# EasyEDA Pro project ProPrj_六无刷——关节电机C_2026-07-28.epro, schematic Schematic1
Board Name: Board1; Create Date: 2026-04-03; Page Name: P1; Project Name: 六无刷——关节电机C; Schematic Name: Schematic1; Update Date: 2026-06-08; Company: 嘉立创EDA; Page Size: A4; Version: V1.0
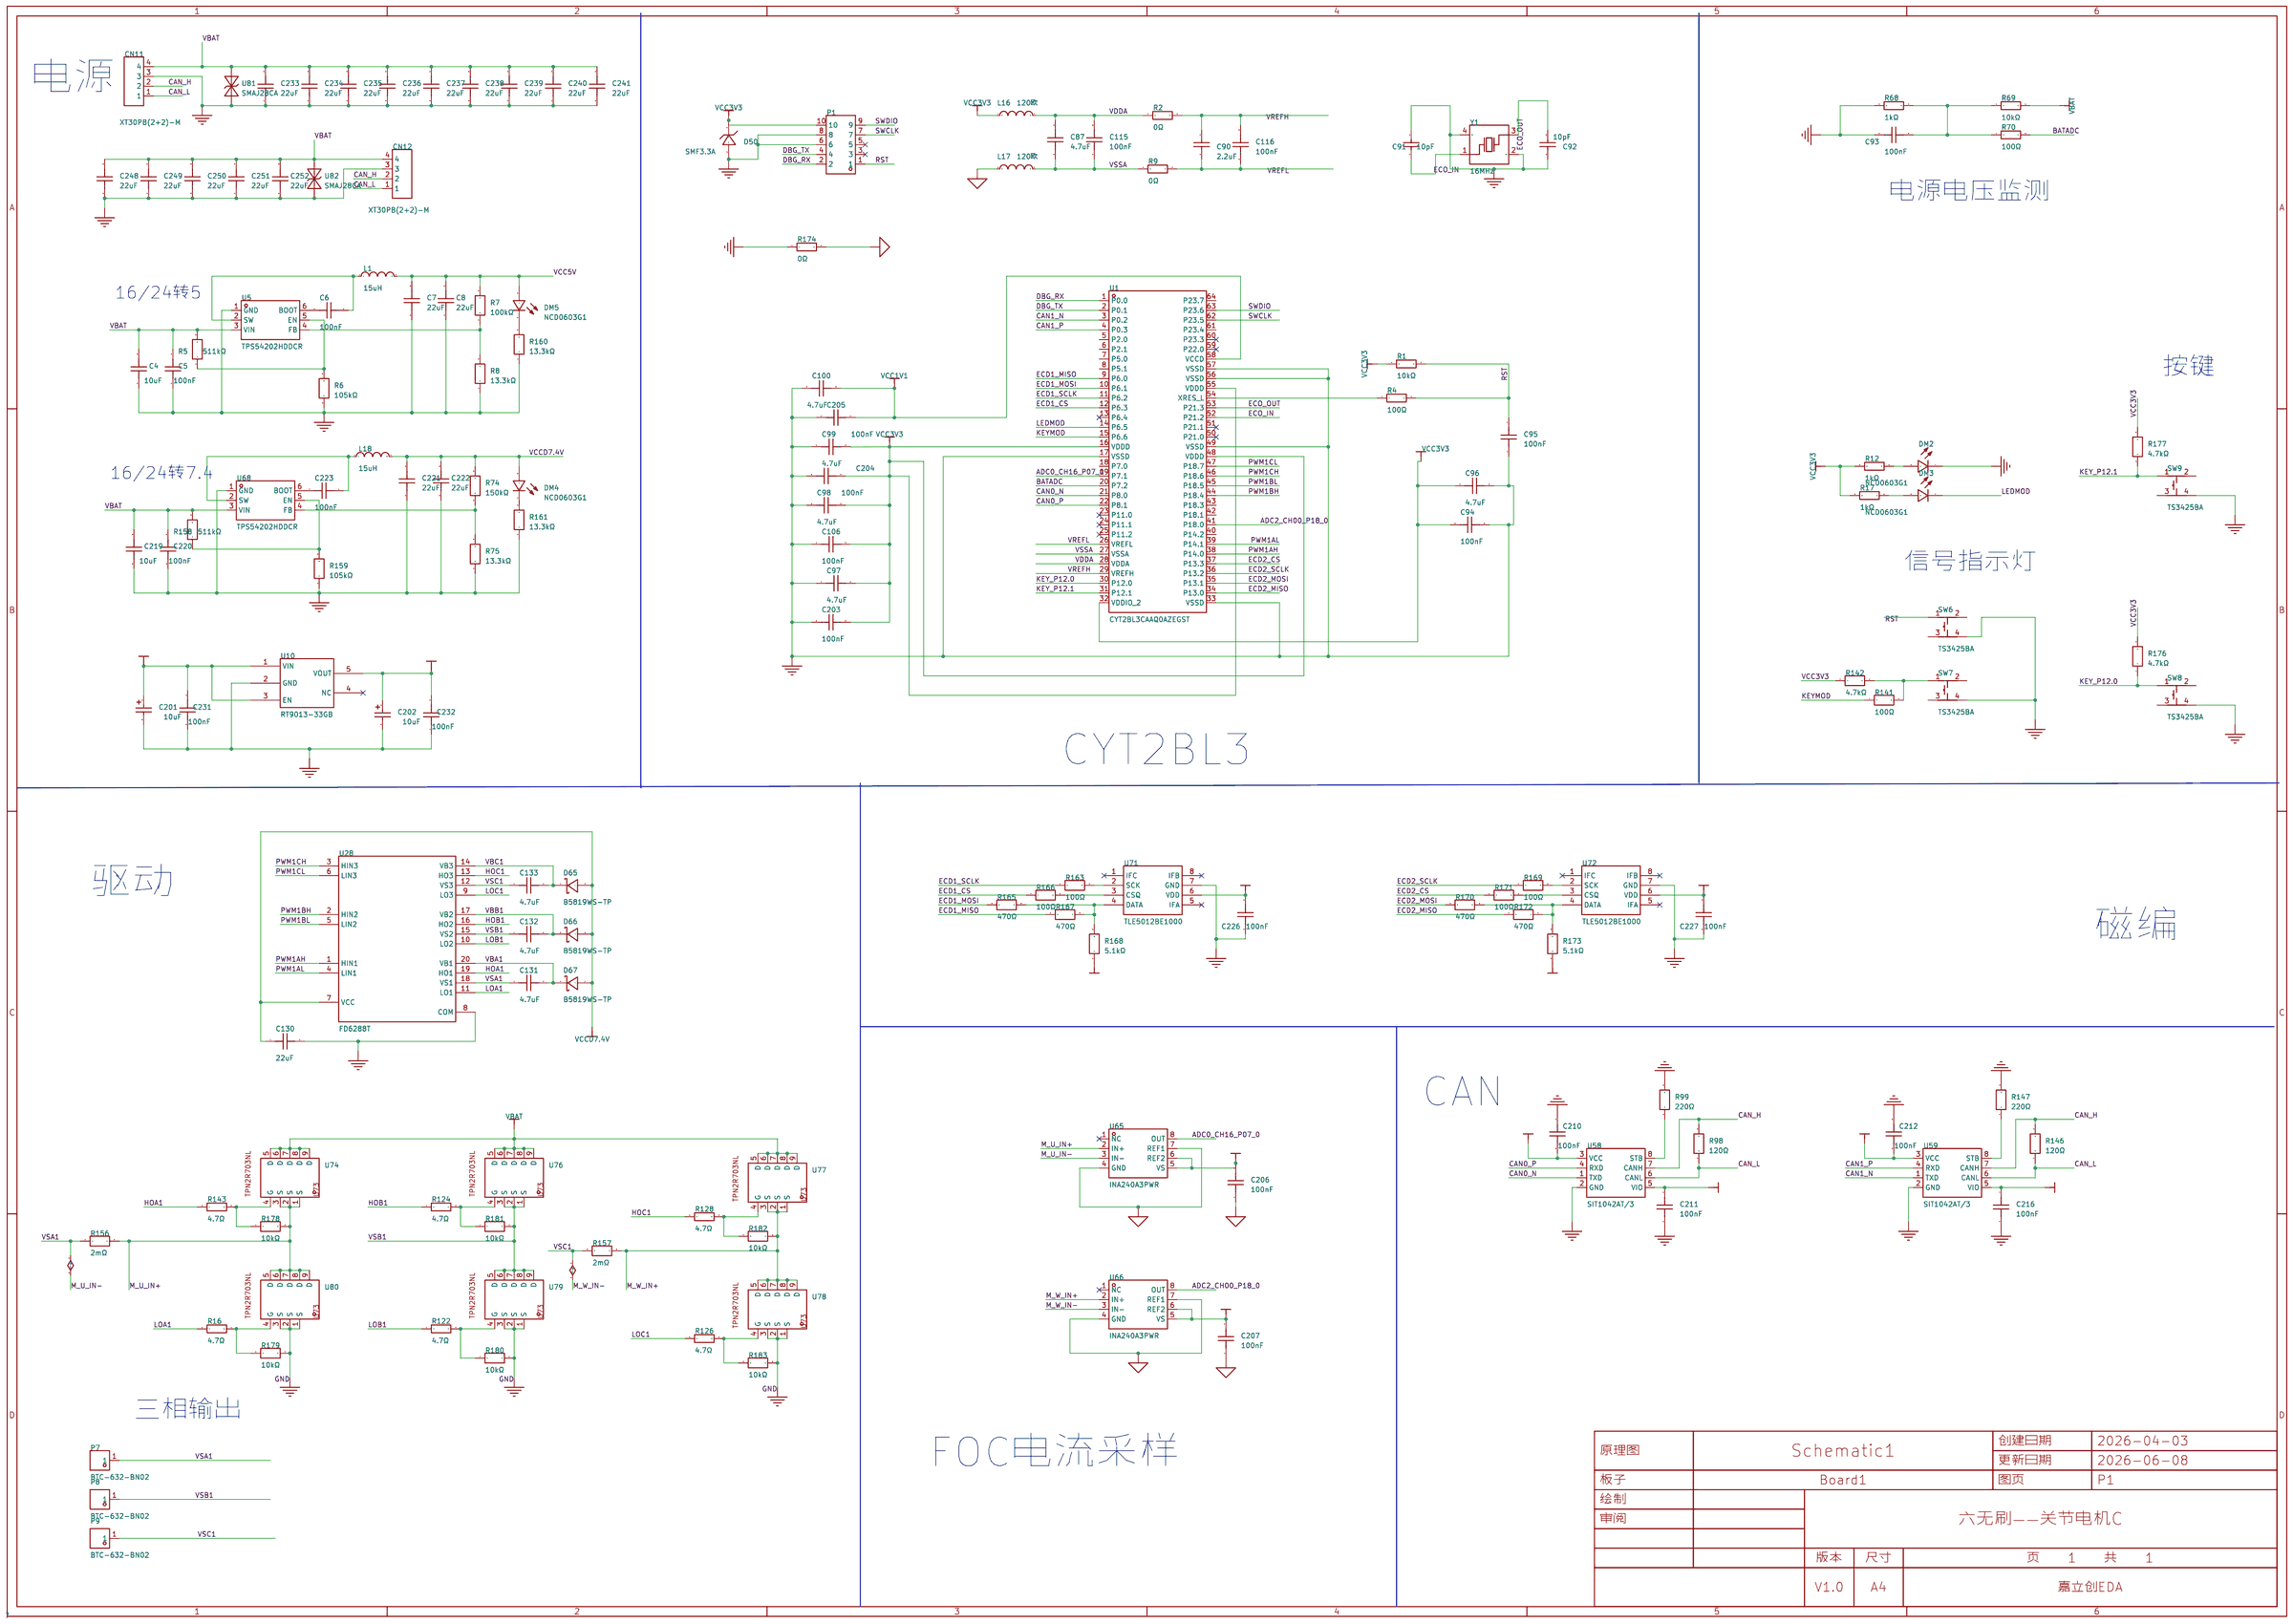
[diagram p0: schematic sheet]

## Parts
C4  10uF  [C0603]
C5  100nF  [C0603]
C6  100nF  [C0603]
C7  22uF  [C0603]
C8  22uF  [C0603]
C87  4.7uF  [C0603]
C90  2.2uF  [C0603]
C91  10pF  [C0402]
C92  10pF  [C0402]
C93  100nF  [C0603]
C94  100nF  [C0603]
C95  100nF  [C0603]
C96  4.7uF  [C0603]
C97  4.7uF  [C0603]
C98  4.7uF  [C0603]
C99  4.7uF  [C0603]
C100  4.7uF  [C0603]
C106  100nF  [C0603]
C115  100nF  [C0603]
C116  100nF  [C0603]
C130  22uF  [C0603]
C131  4.7uF  [C0603]
C132  4.7uF  [C0603]
C133  4.7uF  [C0603]
C201  10uF  [CAP-SMD_L3.2-W1.6-RD-C7171]
C202  10uF  [CAP-SMD_L3.2-W1.6-RD-C7171]
C203  100nF  [C0603]
C204  100nF  [C0603]
C205  100nF  [C0603]
C206  100nF  [C0603]
C207  100nF  [C0603]
C210  100nF  [C0603]
C211  100nF  [C0603]
C212  100nF  [C0603]
C216  100nF  [C0603]
C219  10uF  [C0603]
C220  100nF  [C0603]
C221  22uF  [C0603]
C222  22uF  [C0603]
C223  100nF  [C0603]
C226  100nF  [C0603]
C227  100nF  [C0603]
C231  100nF  [C0603]
C232  100nF  [C0603]
C233  22uF  [C1206]
C234  22uF  [C1206]
C235  22uF  [C1206]
C236  22uF  [C1206]
C237  22uF  [C1206]
C238  22uF  [C1206]
C239  22uF  [C1206]
C240  22uF  [C1206]
C241  22uF  [C1206]
C248  22uF  [C1206]
C249  22uF  [C1206]
C250  22uF  [C1206]
C251  22uF  [C1206]
C252  22uF  [C1206]
CN11  XT30PB(2+2)-M  [CONN-TH_XT30PB-M]
CN12  XT30PB(2+2)-M  [CONN-TH_XT30PB-M]
D50  SMF3.3A  [SOD-123_L2.8-W1.8-LS3.7-RD]
D65  B5819WS-TP  [SOD-323_L1.8-W1.3-LS2.5-RD]
D66  B5819WS-TP  [SOD-323_L1.8-W1.3-LS2.5-RD]
D67  B5819WS-TP  [SOD-323_L1.8-W1.3-LS2.5-RD]
DM2  NCD0603G1  [LED0603-RD]
DM3  NCD0603G1  [LED0603-RD]
DM4  NCD0603G1  [LED0603-RD]
DM5  NCD0603G1  [LED0603-RD]
L1  15uH  [IND-SMD_L7.0-W6.6_FXL0630]
L16  120欧  [L0603]
L17  120欧  [L0603]
L18  15uH  [IND-SMD_L7.0-W6.6_FXL0630]
P1  HDR2X5-2.54座  [HDR-TH_10P_C9900008731]
P7  BTC-632-BN02  [CONN-SMD_BTC-632-BN02]
P8  BTC-632-BN02  [CONN-SMD_BTC-632-BN02]
P9  BTC-632-BN02  [CONN-SMD_BTC-632-BN02]
R1  10kΩ  [R0603]
R2  0Ω  [R0603]
R4  100Ω  [R0603]
R5  511kΩ  [R0603]
R6  105kΩ  [R0603]
R7  100kΩ  [R0603]
R8  13.3kΩ  [R0603]
R9  0Ω  [R0603]
R12  1kΩ  [R0603]
R16  4.7Ω  [R0603]
R17  1kΩ  [R0603]
R68  1kΩ  [R0603]
R69  10kΩ  [R0603]
R70  100Ω  [R0603]
R74  150kΩ  [R0603]
R75  13.3kΩ  [R0603]
R98  120Ω  [R0603]
R99  220Ω  [R0603]
R122  4.7Ω  [R0603]
R124  4.7Ω  [R0603]
R126  4.7Ω  [R0603]
R128  4.7Ω  [R0603]
R141  100Ω  [R0603]
R142  4.7kΩ  [R0603]
R143  4.7Ω  [R0603]
R146  120Ω  [R0603]
R147  220Ω  [R0603]
R156  2mΩ  [R1206]
R157  2mΩ  [R1206]
R158  511kΩ  [R0603]
R159  105kΩ  [R0603]
R160  13.3kΩ  [R0603]
R161  13.3kΩ  [R0603]
R163  100Ω  [R0603]
R165  470Ω  [R0603]
R166  100Ω  [R0603]
R167  470Ω  [R0603]
R168  5.1kΩ  [R0603]
R169  100Ω  [R0603]
R170  470Ω  [R0603]
R171  100Ω  [R0603]
R172  470Ω  [R0603]
R173  5.1kΩ  [R0603]
R174  0Ω  [R0603]
R176  4.7kΩ  [R0603]
R177  4.7kΩ  [R0603]
R178  10kΩ  [R0603]
R179  10kΩ  [R0603]
R180  10kΩ  [R0603]
R181  10kΩ  [R0603]
R182  10kΩ  [R0603]
R183  10kΩ  [R0603]
SW6  TS3425BA  [SW-SMD_4P-L4.2-W3.2-P2.15-LS4.6-1]
SW7  TS3425BA  [SW-SMD_4P-L4.2-W3.2-P2.15-LS4.6-1]
SW8  TS3425BA  [SW-SMD_4P-L4.2-W3.2-P2.15-LS4.6-1]
SW9  TS3425BA  [SW-SMD_4P-L4.2-W3.2-P2.15-LS4.6-1]
U1  CYT2BL3CAAQ0AZEGST  [LQFP-64_L10.0-W10.0-P0.50-LS12.0-BL]
U5  TPS54202HDDCR  [SOT-23-6_L2.9-W1.6-P0.95-LS2.8-BL]
U10  RT9013-33GB  [SOT-25]
U28  FD6288T  [TSSOP-20_L6.5-W4.4-P0.65-LS6.4-BL]
U58  SIT1042AT/3  [SOIC-8_L4.9-W3.9-P1.27-LS6.0-BL]
U59  SIT1042AT/3  [SOIC-8_L4.9-W3.9-P1.27-LS6.0-BL]
U65  INA240A3PWR  [TSSOP-8_L4.4-W3.0-P0.65-LS6.4-BL-2]
U66  INA240A3PWR  [TSSOP-8_L4.4-W3.0-P0.65-LS6.4-BL-2]
U68  TPS54202HDDCR  [SOT-23-6_L2.9-W1.6-P0.95-LS2.8-BL]
U71  TLE5012BE1000  [PG-DSO-8_L5.0-W4.0-P1.27-LS6.0-BL]
U72  TLE5012BE1000  [PG-DSO-8_L5.0-W4.0-P1.27-LS6.0-BL]
U74  -  [TPN2R703NL改焊盘]
U76  -  [TPN2R703NL改焊盘]
U77  -  [TPN2R703NL改焊盘]
U78  -  [TPN2R703NL改焊盘]
U79  -  [TPN2R703NL改焊盘]
U80  -  [TPN2R703NL改焊盘]
U81  SMAJ28CA  [SMA_L4.3-W2.7-LS5.1-BI]
U82  SMAJ28CA  [SMA_L4.3-W2.7-LS5.1-BI]
Y1  16MHz  [CRYSTAL-SMD_4P-L3.2-W2.5-BL]

## Library data of the parts
C4 C219 = FCC0603X106M160CT: 容值:10uF;精度:±20%;额定电压:16V;温度系数:X5R;; LCSC Part Name: 10uF ±20% 16V; Supplier Part: C7467046; Manufacturer: FOJAN(富捷); Supplier Footprint: 0603; JLCPCB Part Class: 扩展库; Datasheet: https://item.szlcsc.com/datasheet/FCC0603X106M160CT/8513633.html; Supplier: LCSC; Tolerance: ±20%; Voltage Rating: 16V; Temperature Coefficient: X5R
C5 C6 C220 C223 C231 C232 = TCC0603X7R104K101CTM: 容值:100nF;精度:±10%;额定电压:100V;温度系数:X7R;; LCSC Part Name: 100nF ±10% 100V; Supplier Part: C48543656; Manufacturer: CCTC(三环); Supplier Footprint: 0603; Datasheet: https://item.szlcsc.com/datasheet/TCC0603X7R104K101CTM/50806427.html; Supplier: LCSC; Tolerance: ±10%; Voltage Rating: 100V; Temperature Coefficient: X7R
C7 C8 C221 C222 = FCC0603X226M160CT: 容值:22uF;精度:±20%;额定电压:16V;温度系数:X5R;; LCSC Part Name: 22uF ±20% 16V; Supplier Part: C46635925; Manufacturer: FOJAN(富捷); Supplier Footprint: 0603; Datasheet: https://item.szlcsc.com/datasheet/FCC0603X226M160CT/48791858.html; Supplier: LCSC; Tolerance: ±20%; Voltage Rating: 16V; Temperature Coefficient: X5R
C87 C96-C100 C131-C133 = CL10A475KO8NNNC: 容值:4.7uF;精度:±10%;额定电压:16V;材质(温度系数):X5R;; LCSC Part Name: 4.7uF ±10% 16V; Supplier Part: C19666; Manufacturer: SAMSUNG(三星); Supplier Footprint: 0603; JLCPCB Part Class: 基础库; Datasheet: https://atta.szlcsc.com/upload/public/pdf/source/20160218/1457707763339.pdf; Supplier: LCSC; Tolerance: ±10%; Voltage Rated: 16V; Temperature Coefficient: X5R
C90 = CL10A225KO8NNNC: 容值:2.2uF;精度:±10%;额定电压:16V;材质(温度系数):X5R;; LCSC Part Name: 2.2uF ±10% 16V; Supplier Part: C23630; Manufacturer: SAMSUNG(三星); Supplier Footprint: 0603; JLCPCB Part Class: 基础库; Datasheet: https://atta.szlcsc.com/upload/public/pdf/source/20160218/1457707763339.pdf; Supplier: LCSC; Tolerance: ±10%; Voltage Rated: 16V; Temperature Coefficient: X5R
C91 C92 = CC0402JRNPO9BN100: 容值:10pF;精度:±5%;额定电压:50V;材质(温度系数):NP0;; LCSC Part Name: 10pF ±5% 50V; Supplier Part: C106199; Manufacturer: YAGEO(国巨); Supplier Footprint: 0402; JLCPCB Part Class: 扩展库; Datasheet: https://atta.szlcsc.com/upload/public/pdf/source/20181008/C309499_21CC21451B82C39E3D92150FD6B30293.pdf; Supplier: LCSC; Tolerance: ±5%; Voltage Rated: 50V; Temperature Coefficient: NP0
C93-C95 C106 C115 C116 C203-C207 C226 C227 = CC0603KRX7R9BB104: 容值:100nF;精度:±10%;额定电压:50V;材质(温度系数):X7R;; LCSC Part Name: 100nF ±10% 50V; Supplier Part: C14663; Manufacturer: YAGEO(国巨); Supplier Footprint: 0603; Datasheet: https://atta.szlcsc.com/upload/public/pdf/source/20180910/C282072_33301C7F631E79921B82A8DAC6BCC5B3.pdf; Supplier: LCSC; Tolerance: ±10%; Voltage Rated: 50V; Temperature Coefficient: X7R
C130 = CGA0603X5R226M160JT: 容值:22uF;精度:±20%;额定电压:16V;材质(温度系数):X5R;; LCSC Part Name: 22uF ±20% 16V; Supplier Part: C6119868; Manufacturer: HRE(芯声); Supplier Footprint: 0603; JLCPCB Part Class: 扩展库; Supplier: LCSC; Tolerance: ±20%; Voltage Rated: 16V; Temperature Coefficient: X5R
C201 C202 = TAJA106K016RNJ: 容值:10uF;精度:±10%;额定电压:16V;等效串联电阻(ESR):3Ω@100kHz;; LCSC Part Name: 10uF ±10% 16V; Supplier Part: C7171; Manufacturer: Kyocera AVX; Supplier Footprint: CASE-A-3216-18(mm); JLCPCB Part Class: 基础库; Supplier: LCSC; Tolerance: ±10%; Voltage Rating: 16V; Equivalent Series Resistance(ESR): 3Ω@100kHz; Operating Temperature: -55℃~+125℃
C210-C212 C216 = TCC0603X7R104J101CT: 容值:100nF;精度:±5%;额定电压:100V;温度系数:X7R;; LCSC Part Name: 100nF ±5% 100V; Supplier Part: C18185760; Manufacturer: CCTC(三环); Supplier Footprint: 0603; JLCPCB Part Class: 扩展库; Datasheet: https://item.szlcsc.com/datasheet/TCC0603X7R104J101CT/19332534.html; Supplier: LCSC; Tolerance: ±5%; Voltage Rating: 100V; Temperature Coefficient: X7R
C233-C241 C248-C252 = CGA1206X5R226M100NT: 容值:22uF;精度:±20%;额定电压:10V;温度系数:X5R;; LCSC Part Name: 22uF ±20% 10V; Supplier Part: C53282218; Manufacturer: HRE(芯声); Supplier Footprint: 1206; JLCPCB Part Class: 扩展库; Datasheet: https://item.szlcsc.com/datasheet/CGA1206X5R226M100NT/56352666.html; Supplier: LCSC; Tolerance: ±20%; Voltage Rating: 10V; Temperature Coefficient: X5R
CN11 CN12 = XT30PB(2+2)-M: 连接器类型:板端/插座-闭口;结构:1x2P;间距:5mm;安装方式:直插;排数:1;每排PIN数:2;; LCSC Part Name: 1x2P 5mm 排数:1 每排P数:2; Supplier Part: C3040128; Manufacturer: AMASS(艾迈斯); Supplier Footprint: 插件,P=5mm; JLCPCB Part Class: 扩展库; Datasheet: https://item.szlcsc.com/datasheet/XT30PB(2%252B2)-M/3596557.html; Supplier: LCSC; Connector Type: 板端/插座-闭口; Number of Positions or Pins: 1x2P; Pitch: 5mm; Mounting Type: 直插; Number of Pins: 4P; Number of Rows: 1; Number of PINs Per Row: 2
D50 = SMF3.3A_C283866: 反向截止电压(Vrwm):3.3V;最大钳位电压:8V;峰值脉冲电流(Ipp)@10/1000us:25A;击穿电压:5.2V;; Supplier Part: C283866; Manufacturer: DOWO(东沃); Supplier Footprint: SOD-123FL; JLCPCB Part Class: 扩展库; Datasheet: https://atta.szlcsc.com/upload/public/pdf/source/20240321/1BA336232F2D97E4B026619682DB80D3.pdf; Supplier: LCSC; Reverse Stand-Off Voltage (Vrwm): 3.3V; Maximum Clamping Voltage: 8V; Peak Pulse Current (Ipp)@10/1000us: 25A; Breakdown Voltage: 5.2V; Reverse Leakage Current (Ir): 600uA; Type: TVS
D65-D67 = B5819WS-TP: 正向压降(Vf):600mV@1A;直流反向耐压(Vr):40V;平均整流电流(Io):1A;; LCSC Part Name: 电压:40V 电流:1A; Supplier Part: C78734; Manufacturer: MCC(美微科); Supplier Footprint: SOD-323; JLCPCB Part Class: 扩展库; Datasheet: https://atta.szlcsc.com/upload/public/pdf/source/20190308/C78734_7BD7F562D63F05C7B4187010ADA330AA.pdf; Supplier: LCSC; Forward Voltage (Vf@If): 600mV@1A; Reverse Voltage (Vr): 40V; Average Rectified Current (Io): 1A; Reverse Leakage Current (Ir): 1mA@40V
DM2-DM5 = NCD0603G1: Supplier Part: C84267; Supplier Footprint: 0603; Datasheet: https://atta.szlcsc.com/upload/public/pdf/source/20200820/C84267_04BA7703640BAC111D09F5EFB971FBF3.pdf; Supplier: LCSC
L1 L18 = FXL0630-150-M: 电感值:15uH;精度:±20%;额定电流:3A;饱和电流(Isat):4.5A;类型:一体成型电感;; LCSC Part Name: 15uH ±20% 4.5A; Supplier Part: C177243; Manufacturer: cjiang(长江微电); Supplier Footprint: SMD,6.6x7mm; JLCPCB Part Class: 扩展库; Datasheet: https://atta.szlcsc.com/upload/public/pdf/source/20240426/3189EA8206330E2108542F9E34E540E7.pdf; Supplier: LCSC; Tolerance: ±20%; Rated Current: 3A; Saturation Current (Isat): 4.5A; DC Resistance (DCR): 115mΩ; Type: 一体成型电感
L16 L17 = MGGB1608M501HT-LF: 标称阻抗@测试频率:500Ω@100MHz;误差:±25%;直流电阻(RDC):-;; LCSC Part Name: 单路 0603磁珠 阻抗500Ω@100MHz; Supplier Part: C281149; Manufacturer: microgate(麦捷科技); Supplier Footprint: 0603; JLCPCB Part Class: 扩展库; Datasheet: https://atta.szlcsc.com/upload/public/pdf/source/20200220/C486339_8AC995628986C74D95A8947231DBAF68.pdf; Supplier: LCSC; Impedance @ Frequency: 500Ω@100MHz; Tolerance: ±25%; Circuits: 1
P1 = HDR2X5-2.54座: Supplier Part: C9900008731; Supplier Footprint: MHDR2X5; JLCPCB Part Class: 扩展库; Supplier: LCSC
P7-P9 = BTC-632-BN02: 长6mm 宽3mm 厚2mm 黄铜镀镍导电铜块 SMD贴片编带载带小铜片 触点散热铜柱 新能源 高压大电流; LCSC Part Name: 长6mm 宽3mm 厚2mm 黄铜镀镍导电铜块 SMD贴片编带载带小铜片 触点散热铜柱 新能源 高压大电流; Supplier Part: C41368650; Manufacturer: BZXC(博众新材); Supplier Footprint: 6x3x2; JLCPCB Part Class: 扩展库; Datasheet: https://atta.szlcsc.com/upload/public/pdf/source/20241125/1C064E3BE876D9C5AD4307841F6D82AB.pdf; Supplier: LCSC
R1 R69 = 0603WAF1002T5E: 电阻类型:厚膜电阻;阻值:10kΩ;精度:±1%;功率:100mW;最大工作电压:75V;温度系数:±100ppm/℃;; LCSC Part Name: 厚膜电阻 10kΩ ±1% 100mW; Supplier Part: C25804; Manufacturer: UNI-ROYAL(厚声); Supplier Footprint: 0603; JLCPCB Part Class: 基础库; Datasheet: https://atta.szlcsc.com/upload/public/pdf/source/20200306/C422600_1E6D84923E4A46A82E41ADD87F860B5C.pdf; Supplier: LCSC; Type: 厚膜电阻; Tolerance: ±1%; Power(Watts): 100mW; Overload Voltage (Max): 75V; Temperature Coefficient: ±100ppm/℃; Operating Temperature Range: -55℃~+155℃
R2 R9 R174 = 0603WAF0000T5E: 电阻类型:厚膜电阻;阻值:0Ω;精度:±1%;功率:100mW;最大工作电压:75V;; LCSC Part Name: 0Ω ±1% 100mW 厚膜电阻; Supplier Part: C21189; Manufacturer: UNI-ROYAL(厚声); Supplier Footprint: 0603; JLCPCB Part Class: 基础库; Datasheet: https://atta.szlcsc.com/upload/public/pdf/source/20200306/C422600_1E6D84923E4A46A82E41ADD87F860B5C.pdf; Supplier: LCSC; Type: 厚膜电阻; Tolerance: ±1%; Power(Watts): 100mW; Overload Voltage (Max): 75V; Operating Temperature Range: -55℃~+155℃
R4 R70 = 0603WAF1000T5E: 电阻类型:厚膜电阻;阻值:100Ω;精度:±1%;功率:100mW;最大工作电压:75V;温度系数:±200ppm/℃;; LCSC Part Name: 100Ω ±1% 100mW 厚膜电阻; Supplier Part: C22775; Manufacturer: UNI-ROYAL(厚声); Supplier Footprint: 0603; JLCPCB Part Class: 基础库; Datasheet: https://atta.szlcsc.com/upload/public/pdf/source/20200306/C422600_1E6D84923E4A46A82E41ADD87F860B5C.pdf; Supplier: LCSC; Type: 厚膜电阻; Tolerance: ±1%; Power(Watts): 100mW; Overload Voltage (Max): 75V; Temperature Coefficient: ±200ppm/℃; Operating Temperature Range: -55℃~+155℃
R5 R158 = RT0603BRD07511KL: 电阻类型:薄膜电阻;阻值:511kΩ;精度:±0.1%;功率:100mW;工作电压:75V;温度系数:±25ppm/℃;; LCSC Part Name: 薄膜电阻 511kΩ ±0.1% 100mW; Supplier Part: C861454; Manufacturer: YAGEO(国巨); Supplier Footprint: 0603; JLCPCB Part Class: 扩展库; Datasheet: https://item.szlcsc.com/datasheet/RT0603BRD07511KL/921792.html; Supplier: LCSC; Type: 薄膜电阻; Tolerance: ±0.1%; Power(Watts): 100mW; Voltage-Supply(Max): 75V; Temperature Coefficient: ±25ppm/℃; Operating Temperature: -55℃~+155℃
R6 R159 = RT0603BRD07105KL: 电阻类型:薄膜电阻;阻值:105kΩ;精度:±0.1%;功率:100mW;温度系数:±25ppm/℃;; LCSC Part Name: 薄膜电阻 105kΩ ±0.1% 100mW; Supplier Part: C861072; Manufacturer: YAGEO(国巨); Supplier Footprint: 0603; Datasheet: https://atta.szlcsc.com/upload/public/pdf/source/20200610/C326738_5639A9F1B6EB6E4AE2197577D3456E7F.pdf; Supplier: LCSC; Type: 薄膜电阻; Tolerance: ±0.1%; Power(Watts): 100mW; Temperature Coefficient: ±25ppm/℃; Operating Temperature Range: -55℃~+155℃
R7 = AR03BTCX1003A: 电阻类型:薄膜电阻;阻值:100kΩ;精度:±0.1%;功率:100mW;工作电压:75V;温度系数:±25ppm/℃;; LCSC Part Name: 薄膜电阻 100kΩ ±0.1% 100mW; Supplier Part: C2924127; Manufacturer: Viking(光颉); Supplier Footprint: 0603; Datasheet: https://item.szlcsc.com/datasheet/AR03BTCX1003A/3238131.html; Supplier: LCSC; Type: 薄膜电阻; Tolerance: ±0.1%; Power(Watts): 100mW; Voltage-Supply(Max): 75V; Temperature Coefficient: ±25ppm/℃; Operating Temperature: -55℃~+155℃
R8 R75 R160 R161 = CL0603FN13K3P: 电阻类型:厚膜电阻;阻值:13.3kΩ;精度:±1%;功率:100mW;工作电压:75V;温度系数:±100ppm/℃;; LCSC Part Name: 厚膜电阻 13.3kΩ ±1% 100mW; Supplier Part: C48391777; Manufacturer: 昶龙科技; Supplier Footprint: 0603; JLCPCB Part Class: 扩展库; Datasheet: https://item.szlcsc.com/datasheet/CL0603FN13K3P/50640359.html; Supplier: LCSC; Type: 厚膜电阻; Tolerance: ±1%; Power(Watts): 100mW; Voltage-Supply(Max): 75V; Temperature Coefficient: ±100ppm/℃; Operating Temperature: -55℃~+70℃
R12 R17 R68 = 0603WAF1001T5E: 电阻类型:厚膜电阻;阻值:1kΩ;精度:±1%;功率:100mW;最大工作电压:75V;温度系数:±100ppm/℃;; LCSC Part Name: 1kΩ ±1% 100mW 厚膜电阻; Supplier Part: C21190; Manufacturer: UNI-ROYAL(厚声); Supplier Footprint: 0603; JLCPCB Part Class: 基础库; Datasheet: https://atta.szlcsc.com/upload/public/pdf/source/20200306/C422600_1E6D84923E4A46A82E41ADD87F860B5C.pdf; Supplier: LCSC; Type: 厚膜电阻; Tolerance: ±1%; Power(Watts): 100mW; Overload Voltage (Max): 75V; Temperature Coefficient: ±100ppm/℃; Operating Temperature Range: -55℃~+155℃
R16 R122 R124 R126 R128 R143 = 0603WAF470KT5E: 电阻类型:厚膜电阻;阻值:4.7Ω;精度:±1%;功率:100mW;最大工作电压:75V;温度系数:±400ppm/℃;; LCSC Part Name: 4.7Ω ±1% 100mW 厚膜电阻; Supplier Part: C23164; Manufacturer: UNI-ROYAL(厚声); Supplier Footprint: 0603; JLCPCB Part Class: 基础库; Datasheet: https://atta.szlcsc.com/upload/public/pdf/source/20200306/C422600_1E6D84923E4A46A82E41ADD87F860B5C.pdf; Supplier: LCSC; Type: 厚膜电阻; Tolerance: ±1%; Power(Watts): 100mW; Overload Voltage (Max): 75V; Temperature Coefficient: ±400ppm/℃; Operating Temperature Range: -55℃~+155℃
R74 = AT0603BRE07150KL: 电阻类型:薄膜电阻;阻值:150kΩ;精度:±0.1%;功率:100mW;工作电压:75V;温度系数:±50ppm/℃;; LCSC Part Name: 薄膜电阻 150kΩ ±0.1% 100mW; Supplier Part: C2139667; Manufacturer: YAGEO(国巨); Supplier Footprint: 0603; JLCPCB Part Class: 扩展库; Datasheet: https://item.szlcsc.com/datasheet/AT0603BRE07150KL/2231267.html; Supplier: LCSC; Type: 薄膜电阻; Tolerance: ±0.1%; Power(Watts): 100mW; Voltage-Supply(Max): 75V; Temperature Coefficient: ±50ppm/℃; Operating Temperature: -55℃~+155℃
R98 R146 = SDR03EZPD1200: 电阻类型:厚膜电阻;阻值:120Ω;精度:±0.5%;功率:300mW;温度系数:±100ppm/℃;; LCSC Part Name: 厚膜电阻 120Ω ±0.5% 300mW; Supplier Part: C6293800; Manufacturer: ROHM(罗姆); Supplier Footprint: 0603; JLCPCB Part Class: 扩展库; Datasheet: https://item.szlcsc.com/datasheet/SDR03EZPD1200/7240764.html; Supplier: LCSC; Type: 厚膜电阻; Tolerance: ±0.5%; Power(Watts): 300mW; Temperature Coefficient: ±100ppm/℃; Operating Temperature: -55℃~+155℃
R99 R147 = CL0603FN220RP: 电阻类型:厚膜电阻;阻值:220Ω;精度:±1%;功率:100mW;工作电压:75V;温度系数:±100ppm/℃;; LCSC Part Name: 厚膜电阻 220Ω ±1% 100mW; Supplier Part: C48996823; Manufacturer: 昶龙科技; Supplier Footprint: 0603; JLCPCB Part Class: 扩展库; Datasheet: https://item.szlcsc.com/datasheet/CL0603FN220RP/51336693.html; Supplier: LCSC; Type: 厚膜电阻; Tolerance: ±1%; Power(Watts): 100mW; Voltage-Supply(Max): 75V; Temperature Coefficient: ±100ppm/℃; Operating Temperature: -55℃~+70℃
R141 = AST03100RJ: 阻值:100Ω;精度:±5%;功率:100mW;工作电压:75V;温度系数:±100ppm/℃;; LCSC Part Name: 100R ±5%; Supplier Part: C49330136; Manufacturer: HKR(香港电阻); Supplier Footprint: 0603; JLCPCB Part Class: 扩展库; Datasheet: https://item.szlcsc.com/datasheet/AST03100RJ/51811778.html; Supplier: LCSC; Tolerance: ±5%; Power(Watts): 100mW; Voltage-Supply(Max): 75V; Temperature Coefficient: ±100ppm/℃; Operating Temperature: -55℃~+155℃
R142 R176 R177 = AST034K7J: 电阻类型:-;阻值:4.7kΩ;精度:±5%;功率:100mW;工作电压:75V;温度系数:±100ppm/℃;; LCSC Part Name: 4K7 ±5%; Supplier Part: C49330144; Manufacturer: HKR(香港电阻); Supplier Footprint: 0603; JLCPCB Part Class: 扩展库; Datasheet: https://item.szlcsc.com/datasheet/AST034K7J/51811786.html; Supplier: LCSC; Tolerance: ±5%; Power(Watts): 100mW; Voltage-Supply(Max): 75V; Temperature Coefficient: ±100ppm/℃
R156 R157 = WSLP12062L000FEA: 电阻类型:-;阻值:2mΩ;精度:±1%;功率:1W;温度系数:±275ppm/℃;; LCSC Part Name: 2mΩ ±1% 1W; Supplier Part: C844294; Manufacturer: VISHAY(威世); Supplier Footprint: 1206; JLCPCB Part Class: 扩展库; Datasheet: https://item.szlcsc.com/datasheet/WSLP12062L000FEA/903868.html; Supplier: LCSC; Tolerance: ±1%; Power(Watts): 1W; Temperature Coefficient: ±275ppm/℃; Operating Temperature: -65℃~+170℃
R163 R166 R169 R171 = CMP0603AFX-1000ELF: 电阻类型:厚膜电阻;阻值:100Ω;精度:±1%;功率:250mW;工作电压:75V;温度系数:±100ppm/℃;; LCSC Part Name: 厚膜电阻 100Ω ±1% 250mW; Supplier Part: C1880691; Manufacturer: BOURNS; Supplier Footprint: 0603; JLCPCB Part Class: 扩展库; Datasheet: https://item.szlcsc.com/datasheet/CMP0603AFX-1000ELF/1971510.html; Supplier: LCSC; Type: 厚膜电阻; Tolerance: ±1%; Power(Watts): 250mW; Voltage-Supply(Max): 75V; Temperature Coefficient: ±100ppm/℃; Operating Temperature: -55℃~+155℃
R165 R167 R170 R172 = TRR03EZPJ471: 电阻类型:厚膜电阻;阻值:470Ω;精度:±5%;功率:100mW;温度系数:±200ppm/℃;; LCSC Part Name: 厚膜电阻 470Ω ±5% 100mW; Supplier Part: C3919277; Manufacturer: ROHM(罗姆); Supplier Footprint: 0603; JLCPCB Part Class: 扩展库; Datasheet: https://item.szlcsc.com/datasheet/TRR03EZPJ471/4487811.html; Supplier: LCSC; Type: 厚膜电阻; Tolerance: ±5%; Power(Watts): 100mW; Temperature Coefficient: ±200ppm/℃; Operating Temperature: -55℃~+155℃
R168 R173 = PTFR0603Q5K10N9: 电阻类型:薄膜电阻;阻值:5.1kΩ;精度:±0.02%;功率:100mW;工作电压:100V;温度系数:±10ppm/℃;; LCSC Part Name: 薄膜电阻 5.1kΩ ±0.02% 100mW; Supplier Part: C53280143; Manufacturer: RESI(开步睿思); Supplier Footprint: 0603; Datasheet: https://item.szlcsc.com/datasheet/PTFR0603Q5K10N9/56346576.html; Supplier: LCSC; Type: 薄膜电阻; Tolerance: ±0.02%; Power(Watts): 100mW; Voltage-Supply(Max): 100V; Temperature Coefficient: ±10ppm/℃; Operating Temperature: -55℃~+155℃
R178-R183 = TD03G1002DT: 电阻类型:薄膜电阻;阻值:10kΩ;精度:±0.5%;功率:100mW;工作电压:75V;温度系数:±25ppm/℃;; LCSC Part Name: 薄膜电阻 10kΩ ±0.5% 100mW; Supplier Part: C50097509; Manufacturer: FH(风华); Supplier Footprint: 0603; JLCPCB Part Class: 扩展库; Datasheet: https://item.szlcsc.com/datasheet/TD03G1002DT/52667708.html; Supplier: LCSC; Type: 薄膜电阻; Tolerance: ±0.5%; Power(Watts): 100mW; Voltage-Supply(Max): 75V; Temperature Coefficient: ±25ppm/℃; Operating Temperature: -55℃~+155℃
SW6-SW9 = TS3425BA: 电路结构:单刀单掷;按钮形状:椭圆形按钮;作用力:250gf;安装方式:立贴;开关长度:4.2mm;开关宽度:3.2mm;开关高度:2.5mm;带支架:不带;触点电流:50mA;额定电压(DC):12V;绝缘电阻:100MΩ;机械寿命:10万次;; LCSC Part Name: 4.2*3.2*2.5mm 立贴 轻触开关; Supplier Part: C2681476; Manufacturer: SHOU HAN(首韩); Supplier Footprint: SMD; JLCPCB Part Class: 扩展库; Datasheet: https://atta.szlcsc.com/upload/public/pdf/source/20210107/C2681476_BF217B2301F0070AA49504CB0BFDE895.pdf; Supplier: LCSC; Circuit: 单刀单掷; Actuator Style: 椭圆形按钮; Operating Force: 250gf; Mounting Style: 立贴; Switch Length: 4.2mm; Switch Width: 3.2mm; Switch Height: 2.5mm; Strike Gundam: 不带; Contact Current: 50mA; Voltage Rating (DC): 12V; Insulation Resistance: 100MΩ; Actuator/Cap Color: 白色; Pin Style: J型引脚; Mechanical Life: 10万次; Operating Temperature: -20℃~+85℃
U1 = CYT2BL3CAAQ0AZEGST: CPU内核:ARM-M4；ARM-M0+;CPU最大主频:100MHz；160MHz;应用领域:-;; Supplier Part: C6814187; Manufacturer: Infineon(英飞凌); Supplier Footprint: LQFP-64(10x10); Datasheet: https://atta.szlcsc.com/upload/public/pdf/source/20241028/9C5F45A22757023D6821BF2A2597B3D9.pdf; Supplier: LCSC; CPU Core: ARM-M4；ARM-M0+; CPU Maximum Speed: 100MHz；160MHz; Number of I/O: 49; ADC (Bit): 12bit; Low Voltage Detection Threshold: 2.7V~5.5V
U5 U68 = TPS54202HDDCR: 功能类型:降压型;输出类型:固定;工作电压:4.5V~28V;输出电压:5V;输出电流:2A;; LCSC Part Name: 4.5V至28V输入,2A输出同步降压电压转换器; Supplier Part: C527684; Manufacturer: TI(德州仪器); Supplier Footprint: TSOT-23-6; JLCPCB Part Class: 扩展库; Datasheet: https://www.ti.com/cn/lit/gpn/tps54202h; Supplier: LCSC; Function: 降压型; Output Type: 固定; Input Voltage: 4.5V~28V; Output Voltage: 5V; Output Current: 2A; Switching Frequency: 500kHz; Operating Temperature: -40℃~+125℃; Synchronous Rectification: 是; Number of Outputs: 1; Topology: 降压式; Quiescent Current (Iq): 45uA; Switch tube (built-in/external): 内置
U10 = RT9013-33GB: IC
U28 = FD6288T: 三个独立的半桥栅极驱动集成电路芯片; Supplier Part: C97683; Manufacturer: Fortior Tech(峰岹); Supplier Footprint: TSSOP-20; JLCPCB Part Class: Extended Part; Datasheet: https://atta.szlcsc.com/upload/public/pdf/source/20241101/0E2856EB301EAFFED732065FB088D773.pdf; Supplier: LCSC
U58 U59 = SIT1042AT/3: 类型:CAN-FD收发器;数据速率:5Mbps;; LCSC Part Name: SIT1042A CAN FD待机模式总线收发器; Supplier Part: C5382545; Manufacturer: SIT(芯力特); Supplier Footprint: SOP-8; JLCPCB Part Class: 扩展库; Datasheet: https://item.szlcsc.com/datasheet/SIT1042AT%252F3/6255019.html; Supplier: LCSC; Type: CAN-FD收发器; Data Rate: 5Mbps; Voltage - Supply: 4.5V~5.5V; Current - Supply: 70mA; Operating Temperature: -40℃~+150℃; Supply Current (Iq): 5uA
U65 U66 = INA240A3PWR: 放大器数:单路;共模电压:-4V~80V;增益:100V/V;带宽:400kHz;; LCSC Part Name: -4V至80V、具有增强型PWM抑制的双向、超精密电流检测放大器; Supplier Part: C544538; Manufacturer: TI(德州仪器); Supplier Footprint: TSSOP-8; JLCPCB Part Class: 扩展库; Datasheet: https://www.ti.com/cn/lit/gpn/ina240; Supplier: LCSC; Number of Channels: 单路; Vcm - Common Mode Voltage: -4V~80V; Gain: 100V/V; Bandwidth: 400kHz; Ib - Input Bias Current: 90uA; Vos - Input Offset Voltage: 5uV; Operating Temperature: -40℃~+125℃; Differential Voltage: -80V~+80V; Single Supply: 2.7V~5.5V; Quiescent Current: 1.8mA; Input Offset Voltage Drift(Vos TC): 250nV/℃; Slew Rate: 2V/us; Common Mode Rejection Ratio (CMRR): 132dB; Noise density(eN): 40nV/√Hz@1kHz
U71 U72 = TLE5012BE1000: 采用巨磁电阻的角度传感器; LCSC Part Name: 基于GMR的角度传感器; Supplier Part: C123083; Manufacturer: Infineon(英飞凌); Supplier Footprint: SO-8; JLCPCB Part Class: 扩展库; Datasheet: https://item.szlcsc.com/datasheet/TLE5012BE1000/124353.html; Supplier: LCSC; Out Type: IIF；SSC; Resolution: 15bit; Minimum Field: 30mT; Supply Voltage: 3V~5.5V; Supply Current: 14mA; Operating Temperature: -40℃~+150℃
U74 U76-U80 = TPN2R703NL改焊盘
U81 U82 = SMAJ28CA: 极性:双向;反向截止电压(Vrwm):28V;钳位电压:45.4V;峰值脉冲电流(Ipp):8.8A;峰值脉冲功率(Ppp):400W;击穿电压:31.1V;; LCSC Part Name: 双向TVS 28V截止 峰值脉冲电流：8.8A; Supplier Part: C2985629; Manufacturer: KUU; Supplier Footprint: SMA; JLCPCB Part Class: 扩展库; Datasheet: https://item.szlcsc.com/datasheet/SMAJ28CA/3430233.html; Supplier: LCSC; Polarity: 双向; Reverse Stand-Off Voltage (Vrwm): 28V; Clamping Voltage: 45.4V; Peak Pulse Current (Ipp): 8.8A; Peak Pulse Power Dissipation (Ppp): 400W; Voltage - Breakdown: 31.1V; Reverse Leakage Current (Ir): 1uA; Number of Channels: 单路; Operating Temperature: -55℃~+150℃; Type: TVS
Y1 = TAXM16M4RLBCCT2T: 晶振类型:贴片晶振;频率:16MHz;常温频差:±10ppm;负载电容:20pF;频率稳定度(全温):±15ppm;; LCSC Part Name: 16MHz ±10ppm 20pF; Supplier Part: C164049; Manufacturer: YJX(雅晶鑫); Supplier Footprint: SMD3225-4P; JLCPCB Part Class: 扩展库; Datasheet: https://atta.szlcsc.com/upload/public/pdf/source/20200713/C164049_7D9D040C2FDFEE55E99A1CB38C95A19D.pdf; Supplier: LCSC; Crystal Type: 贴片晶振; Normal temperature Frequency Tolerance: ±10ppm; Load Capacitor: 20pF; Frequency Stability(Full temperature range): ±15ppm; Equivalent Series Resistance (ESR): 40Ω; Operating Temperature: -40℃~+85℃

## Nets
AGND: C206.1 C207.1 L17.1 R174.2 U65.4(GND) U65.7(REF1) U66.4(GND) U66.7(REF1)
GND: C4.1 C5.1 C7.1 C8.1 C91.2 C92.1 C93.1 C94.2 C95.1 C96.2 C97.1 C98.1 C99.1 C100.1 C106.1 C130.2 C201.2 C202.2 C203.1 C204.1 C205.1 C210.1 C211.2 C212.1 C216.2 C219.1 C220.1 C221.1 C222.1 C226.1 C227.1 C231.1 C232.1 C233.1 C234.1 C235.1 C236.1 C237.1 C238.1 C239.1 C240.1 C241.1 C248.1 C249.1 C250.1 C251.1 C252.1 CN11.3 CN12.3 D50.2 DM2.1(K) P1.6 P1.8 R6.1 R8.1 R68.1 R75.1 R99.2 R147.2 R159.1 R160.1 R161.1 R174.1 R179.2 R180.2 R183.2 SW6.4 SW7.4 SW8.4 SW9.4 U1.17(VSSD) U1.33(VSSD) U1.49(VSSD) U1.56(VSSD) U1.57(VSSD) U5.1(GND) U10.2(GND) U28.8(COM) U58.2(GND) U59.2(GND) U68.1(GND) U71.7(GND) U72.7(GND) U78.1(S) U78.2(S) U78.3(S) U79.1(S) U79.2(S) U79.3(S) U80.1(S) U80.2(S) U80.3(S) U81.1 U82.1 Y1.2(GND) Y1.4(GND)
VBAT: C4.2 C5.2 C219.2 C220.2 C233.2 C234.2 C235.2 C236.2 C237.2 C238.2 C239.2 C240.2 C241.2 C248.2 C249.2 C250.2 C251.2 C252.2 CN11.4 CN12.4 R5.2 R69.2 R158.2 U5.3(VIN) U68.3(VIN) U74.5(D) U74.6(D) U74.7(D) U74.8(D) U74.9(D) U76.5(D) U76.6(D) U76.7(D) U76.8(D) U76.9(D) U77.5(D) U77.6(D) U77.7(D) U77.8(D) U77.9(D) U81.2 U82.2
VCC1V1: C100.2 C205.2 U1.58(VCCD)
VCC3V3: C94.1 C96.1 C97.2 C98.2 C106.2 C202.1 C203.2 C204.2 C206.2 C207.2 C211.1 C216.1 C226.2 C227.2 C232.2 D50.1 L16.1 P1.10 R1.1 R12.1 R17.1 R142.1 R168.1 R173.1 R176.2 R177.2 U1.16(VDDD) U1.48(VDDD) U1.55(VDDD) U10.5(VOUT) U58.5(VIO) U59.5(VIO) U65.5(VS) U65.6(REF2) U66.5(VS) U66.6(REF2) U71.6(VDD) U72.6(VDD)
VCC5V: C7.2 C8.2 C201.1 C210.2 C212.2 C231.2 DM5.2(A) L1.2 R7.2 U10.1(VIN) U10.3(EN) U58.3(VCC) U59.3(VCC)
VCCD7.4V: C130.1 C221.2 C222.2 D65.2(A) D66.2(A) D67.2(A) DM4.2(A) L18.2 R74.2 U28.7(VCC)
VDDA: C87.2 C115.2 L16.2 R2.1 U1.28(VDDA)
VSSA: C87.1 C115.1 L17.2 R9.1 U1.27(VSSA)
ADC0_CH16_P07_0: U1.19(P7.1) U65.8(OUT)
ADC2_CH00_P18_0: U1.41(P18.0) U66.8(OUT)
BATADC: R70.2 U1.20(P7.2)
CAN0_N: U1.21(P8.0) U58.1(TXD)
CAN0_P: U1.22(P8.1) U58.4(RXD)
CAN1_N: U1.3(P0.2) U59.1(TXD)
CAN1_P: U1.4(P0.3) U59.4(RXD)
CAN_H: CN11.2 CN12.2 R98.2 R146.2 U58.7(CANH) U59.7(CANH)
CAN_L: CN11.1 CN12.1 R98.1 R146.1 U58.6(CANL) U59.6(CANL)
DBG_RX: P1.2 U1.1(P0.0)
DBG_TX: P1.4 U1.2(P0.1)
ECD1_CS: R166.1 U1.12(P6.3)
ECD1_MISO: R167.1 U1.9(P6.0)
ECD1_MOSI: R165.1 U1.10(P6.1)
ECD1_SCLK: R163.1 U1.11(P6.2)
ECD2_CS: R171.1 U1.37(P13.3)
ECD2_MISO: R172.1 U1.34(P13.0)
ECD2_MOSI: R170.1 U1.35(P13.1)
ECD2_SCLK: R169.1 U1.36(P13.2)
ECO_IN: C91.1 U1.52(P21.2) Y1.1(OSC1)
ECO_OUT: C92.2 U1.53(P21.3) Y1.3(OSC2)
HOA1: R143.1 U28.19(HO1)
HOB1: R124.1 U28.16(HO2)
HOC1: R128.1 U28.13(HO3)
KEY_P12.0: R176.1 SW8.1 U1.30(P12.0)
KEY_P12.1: R177.1 SW9.1 U1.31(P12.1)
KEYMOD: R141.1 U1.15(P6.6)
LEDMOD: DM3.1(K) U1.14(P6.5)
LOA1: R16.1 U28.11(LO1)
LOB1: R122.1 U28.10(LO2)
LOC1: R126.1 U28.9(LO3)
M_U_IN+: R156.2 R178.2 U65.2(IN+) U74.1(S) U74.2(S) U74.3(S) U80.5(D) U80.6(D) U80.7(D) U80.8(D) U80.9(D)
M_U_IN-: C131.1 P7.1 R156.1 U28.18(VS1) U65.3(IN-)
M_W_IN+: R157.2 R182.2 U66.2(IN+) U77.1(S) U77.2(S) U77.3(S) U78.5(D) U78.6(D) U78.7(D) U78.8(D) U78.9(D)
M_W_IN-: C133.1 P9.1 R157.1 U28.12(VS3) U66.3(IN-)
PWM1AH: U1.38(P14.0) U28.1(HIN1)
PWM1AL: U1.39(P14.1) U28.4(LIN1)
PWM1BH: U1.44(P18.4) U28.2(HIN2)
PWM1BL: U1.45(P18.5) U28.5(LIN2)
PWM1CH: U1.46(P18.6) U28.3(HIN3)
PWM1CL: U1.47(P18.7) U28.6(LIN3)
RST: C95.2 P1.1 R1.2 R4.2 SW6.1
SWCLK: P1.7 U1.62(P23.5)
SWDIO: P1.9 U1.63(P23.6)
VBA1: C131.2 D67.1(K) U28.20(VB1)
VBB1: C132.2 D66.1(K) U28.17(VB2)
VBC1: C133.2 D65.1(K) U28.14(VB3)
VREFH: C90.2 C116.2 R2.2 U1.29(VREFH)
VREFL: C90.1 C116.1 R9.2 U1.26(VREFL)
VSB1: C132.1 P8.1 R181.2 U28.15(VS2) U76.1(S) U76.2(S) U76.3(S) U79.5(D) U79.6(D) U79.7(D) U79.8(D) U79.9(D)
$1N528: R5.1 R6.2 U5.5(EN)
$1N530: C6.2 L1.1 U5.2(SW)
$1N533: R7.1 R8.2 U5.4(FB)
$1N534: C6.1 U5.6(BOOT)
$1N2535: R4.1 U1.54(XRES_L)
$1N2819: C93.2 R68.2 R69.1 R70.1
$1N3150: DM2.2(A) R12.2
$1N3152: DM3.2(A) R17.2
$1N3354: R141.2 R142.2 SW7.1
$1N11417: R99.1 U58.8(STB)
$1N11705: R147.1 U59.8(STB)
$1N21195: R158.1 R159.2 U68.5(EN)
$1N21197: C223.2 L18.1 U68.2(SW)
$1N21200: R74.1 R75.2 U68.4(FB)
$1N21201: C223.1 U68.6(BOOT)
$1N29317: R143.2 R178.1 U74.4(G)
$1N29323: R124.2 R181.1 U76.4(G)
$1N29329: R128.2 R182.1 U77.4(G)
$1N29335: R16.2 R179.1 U80.4(G)
$1N29341: R122.2 R180.1 U79.4(G)
$1N29347: R126.2 R183.1 U78.4(G)
$1N29661: DM5.1(K) R160.2
$1N29700: DM4.1(K) R161.2
$1N33855: R165.2 R167.2 R168.2 U71.4(DATA)
$1N33860: R166.2 U71.3(CSQ)
$1N33865: R163.2 U71.2(SCK)
$1N34755: R170.2 R172.2 R173.2 U72.4(DATA)
$1N34761: R171.2 U72.3(CSQ)
$1N34763: R169.2 U72.2(SCK)

Not connected (* = marked no-connect by the designer): C99 2; P1 3* 5*; SW6 2 3; SW7 2 3; SW8 2 3; SW9 2 3; U1 5(P2.0) 6(P2.1) 7(P5.0) 8(P5.1) 13(P6.4)* 18(P7.0) 23(P11.0)* 24(P11.1)* 25(P11.2)* 32(VDDIO_2) 40(P14.2) 42(P18.1) 43(P18.3) 50(P21.0)* 51(P21.1)* 59(P22.0)* 60(P23.3)* 61(P23.4) 64(P23.7); U10 4(NC)*; U65 1(NC)*; U66 1(NC)*; U71 1(IFC)* 5(IFA)* 8(IFB)*; U72 1(IFC)* 5(IFA)* 8(IFB)*

## Notes on the sheet
- 电源
- 电源电压监测
- 16/24转5
- 按键
- 16/24转7.4
- 信号指示灯
- CYT2BL3
- 驱动
- 磁编
- CAN
- 三相输出
- FOC电流采样
